# EAGLE design ambika_polivoks (EAGLE 7.7.0)

## Sheet 1 of 4: MCU, DAC
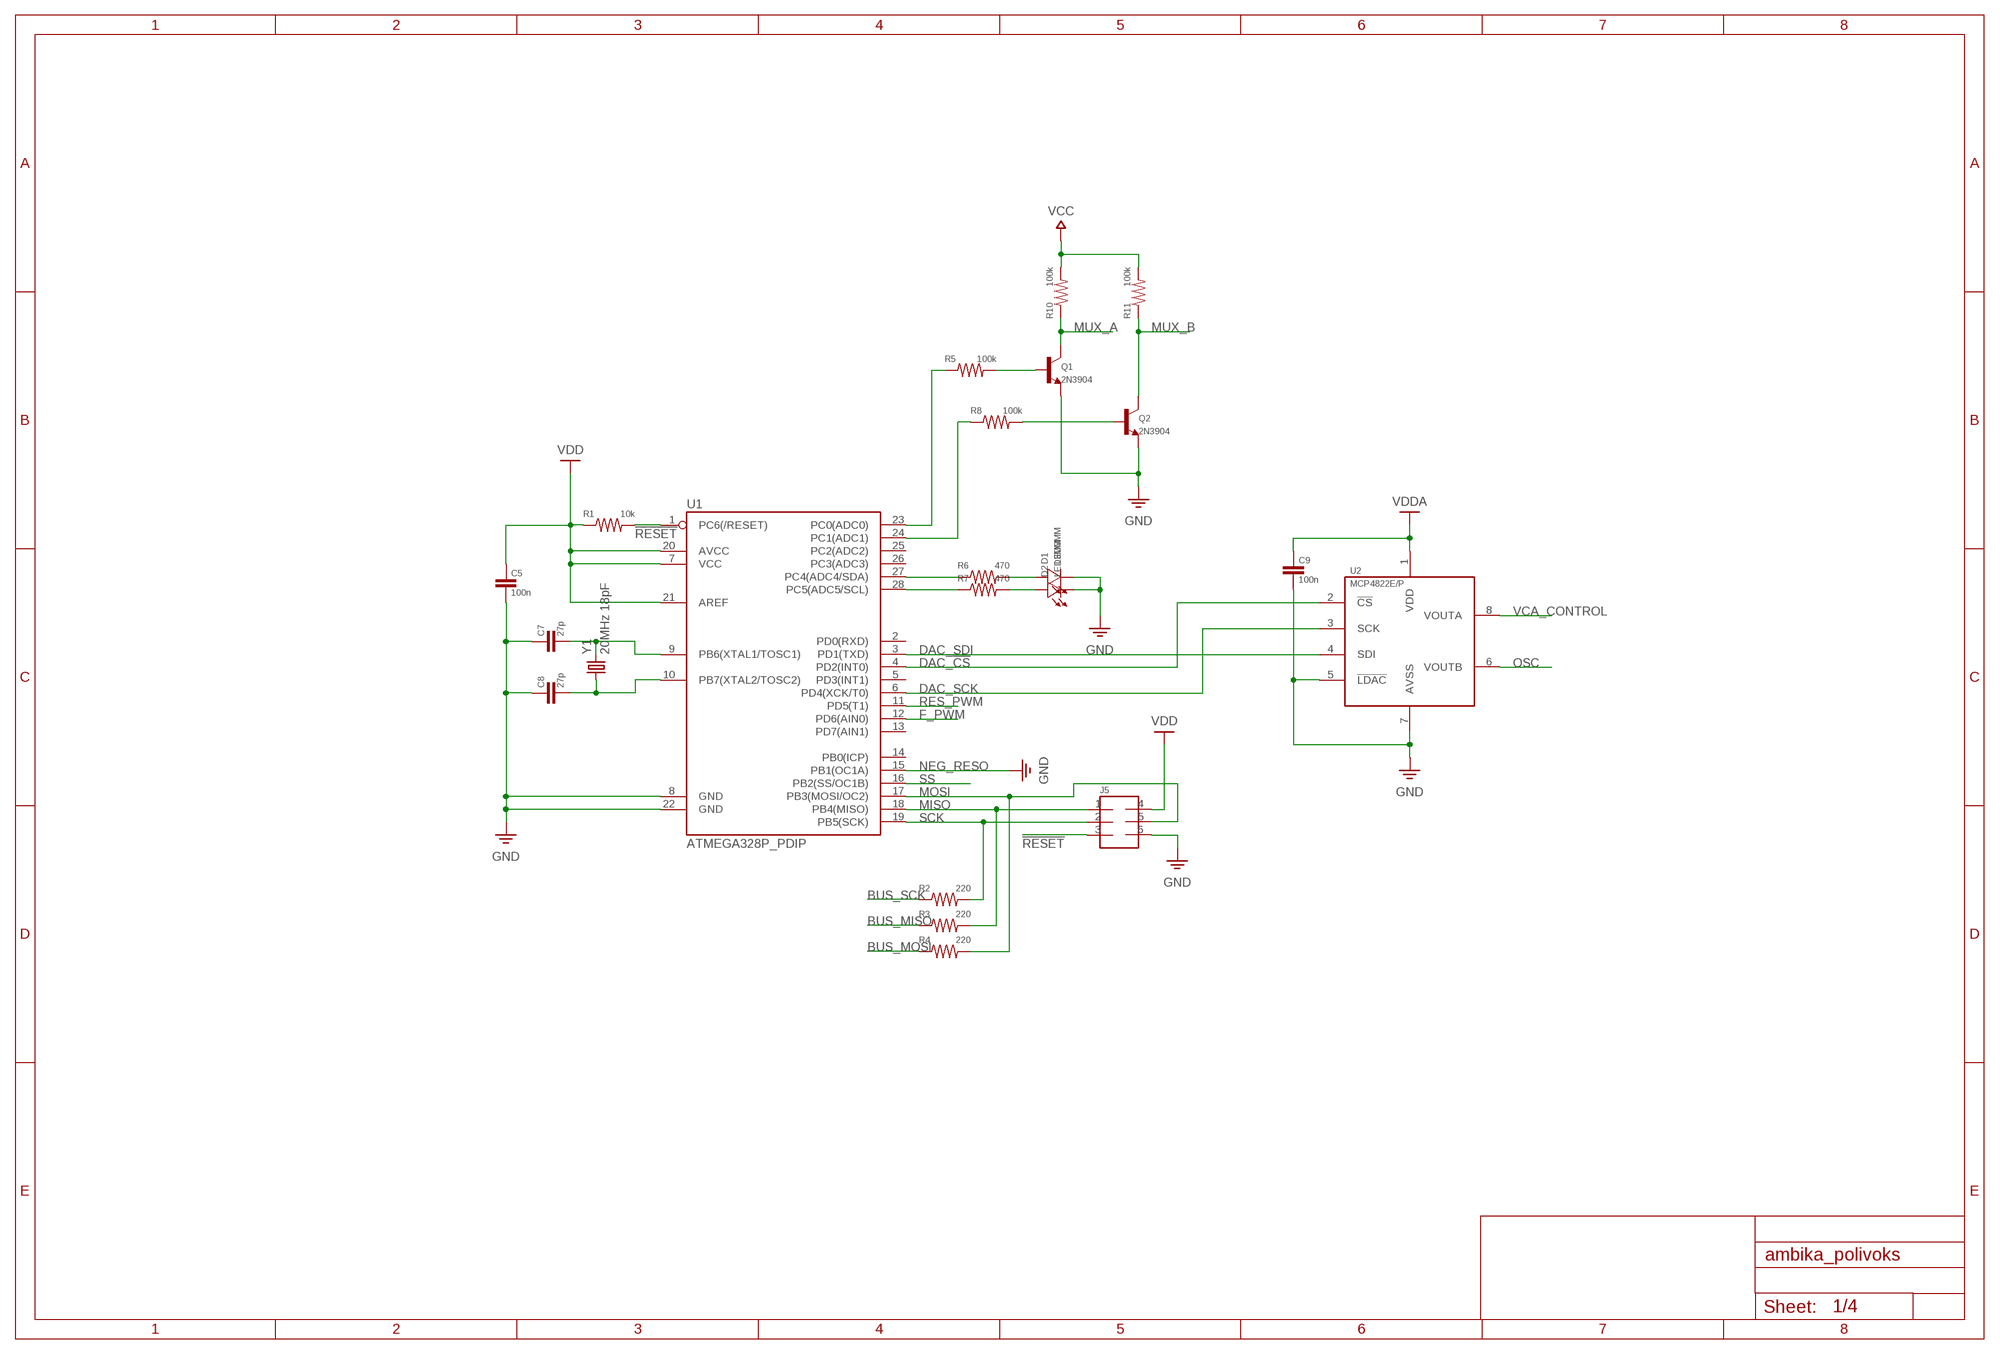
[diagram p0: schematic, sheet 1]

### Parts
C5  100n  CAPACITOR  [CAP_0.1]
C7  27p  CAPACITOR  [CAP_0.1]
C8  27p  CAPACITOR  [CAP_0.1]
C9  100n  CAPACITOR  [CAP_0.1]
D1  LED3MM  [LED3MM]
D2  LED3MM  [LED3MM]
J5  HEADER_2X3  [HEADER_2X3]
Q1  2N3904  [TO-92_TRI]
Q2  2N3904  [TO-92_TRI]
R1  10k  RESISTOR_PTH_1/4W  [RESISTOR_1/4W]
R2  220  RESISTOR_PTH_1/4W  [RESISTOR_1/4W]
R3  220  RESISTOR_PTH_1/4W  [RESISTOR_1/4W]
R4  220  RESISTOR_PTH_1/4W  [RESISTOR_1/4W]
R5  100k  RESISTOR_PTH_1/4W  [RESISTOR_1/4W]
R6  470  RESISTOR_PTH_1/4W  [RESISTOR_1/4W]
R7  470  RESISTOR_PTH_1/4W  [RESISTOR_1/4W]
R8  100k  RESISTOR_PTH_1/4W  [RESISTOR_1/4W]
R10  100k  RESISTOR_PTH_1/4W  [RESISTOR_1/4W]
R11  100k  RESISTOR_PTH_1/4W  [RESISTOR_1/4W]
U1  ATMEGA328P_PDIP  [DIP28]
U2  MCP4822E/P  [DIP8]
Y1  20MHz 18pF  CRYSTALHC49US  [HC49US]

### Nets
!RESET: J5.3 R1.P$2 U1.1(PC6(/RESET))
BUS_MISO: R3.P$1 ; also sheet 3
BUS_MOSI: R4.P$1 ; also sheet 3
BUS_SCK: R2.P$1 ; also sheet 3
DAC_!CS: U1.4(PD2(INT0)) U2.2(!CS)
DAC_SCK: U1.6(PD4(XCK/T0)) U2.3(SCK)
DAC_SDI: U1.3(PD1(TXD)) U2.4(SDI)
F_PWM: U1.12(PD6(AIN0)) ; also sheet 2
GND: C5.2 C7.1 C8.1 C9.2 D1.K D2.K J5.6 Q1.1(E) Q2.1(E) U1.8(GND) U1.15(PB1(OC1A)) U1.22(GND) U2.5(!LDAC) U2.7(AVSS) ; also sheet 2,3
LED1: D2.A R7.P$2
LED2: D1.A R6.P$2
MISO: J5.1 R3.P$2 U1.18(PB4(MISO))
MOSI: J5.5 R4.P$2 U1.17(PB3(MOSI/OC2))
MUX_A: Q1.3(C) R10.P$1 ; also sheet 2
MUX_B: Q2.3(C) R11.P$1 ; also sheet 2
N$1: C7.2 U1.9(PB6(XTAL1/TOSC1)) Y1.2
N$2: C8.2 U1.10(PB7(XTAL2/TOSC2)) Y1.1
N$3: Q1.2(B) R5.P$2
N$5: Q2.2(B) R8.P$2
N$30: R5.P$1 U1.23(PC0(ADC0))
N$31: R8.P$1 U1.24(PC1(ADC1))
OSC: U2.6(VOUTB) ; also sheet 2
PC4: R6.P$1 U1.27(PC4(ADC4/SDA))
PC5: R7.P$1 U1.28(PC5(ADC5/SCL))
RES_PWM: U1.11(PD5(T1)) ; also sheet 2
SCK: J5.2 R2.P$2 U1.19(PB5(SCK))
SS: U1.16(PB2(SS/OC1B)) ; also sheet 3
VCA_CONTROL: U2.8(VOUTA) ; also sheet 2
VCC: R10.P$2 R11.P$2 ; also sheet 2,3
VDD: C5.1 J5.4 R1.P$1 U1.7(VCC) U1.20(AVCC) U1.21(AREF) ; also sheet 3
VDDA: C9.1 U2.1(VDD) ; also sheet 3
Unconnected: U1.2(PD0(RXD)) U1.5(PD3(INT1)) U1.13(PD7(AIN1)) U1.14(PB0(ICP)) U1.25(PC2(ADC2)) U1.26(PC3(ADC3))

### Notes on the sheet
- NEG_RESO

## Sheet 2 of 4: Analog
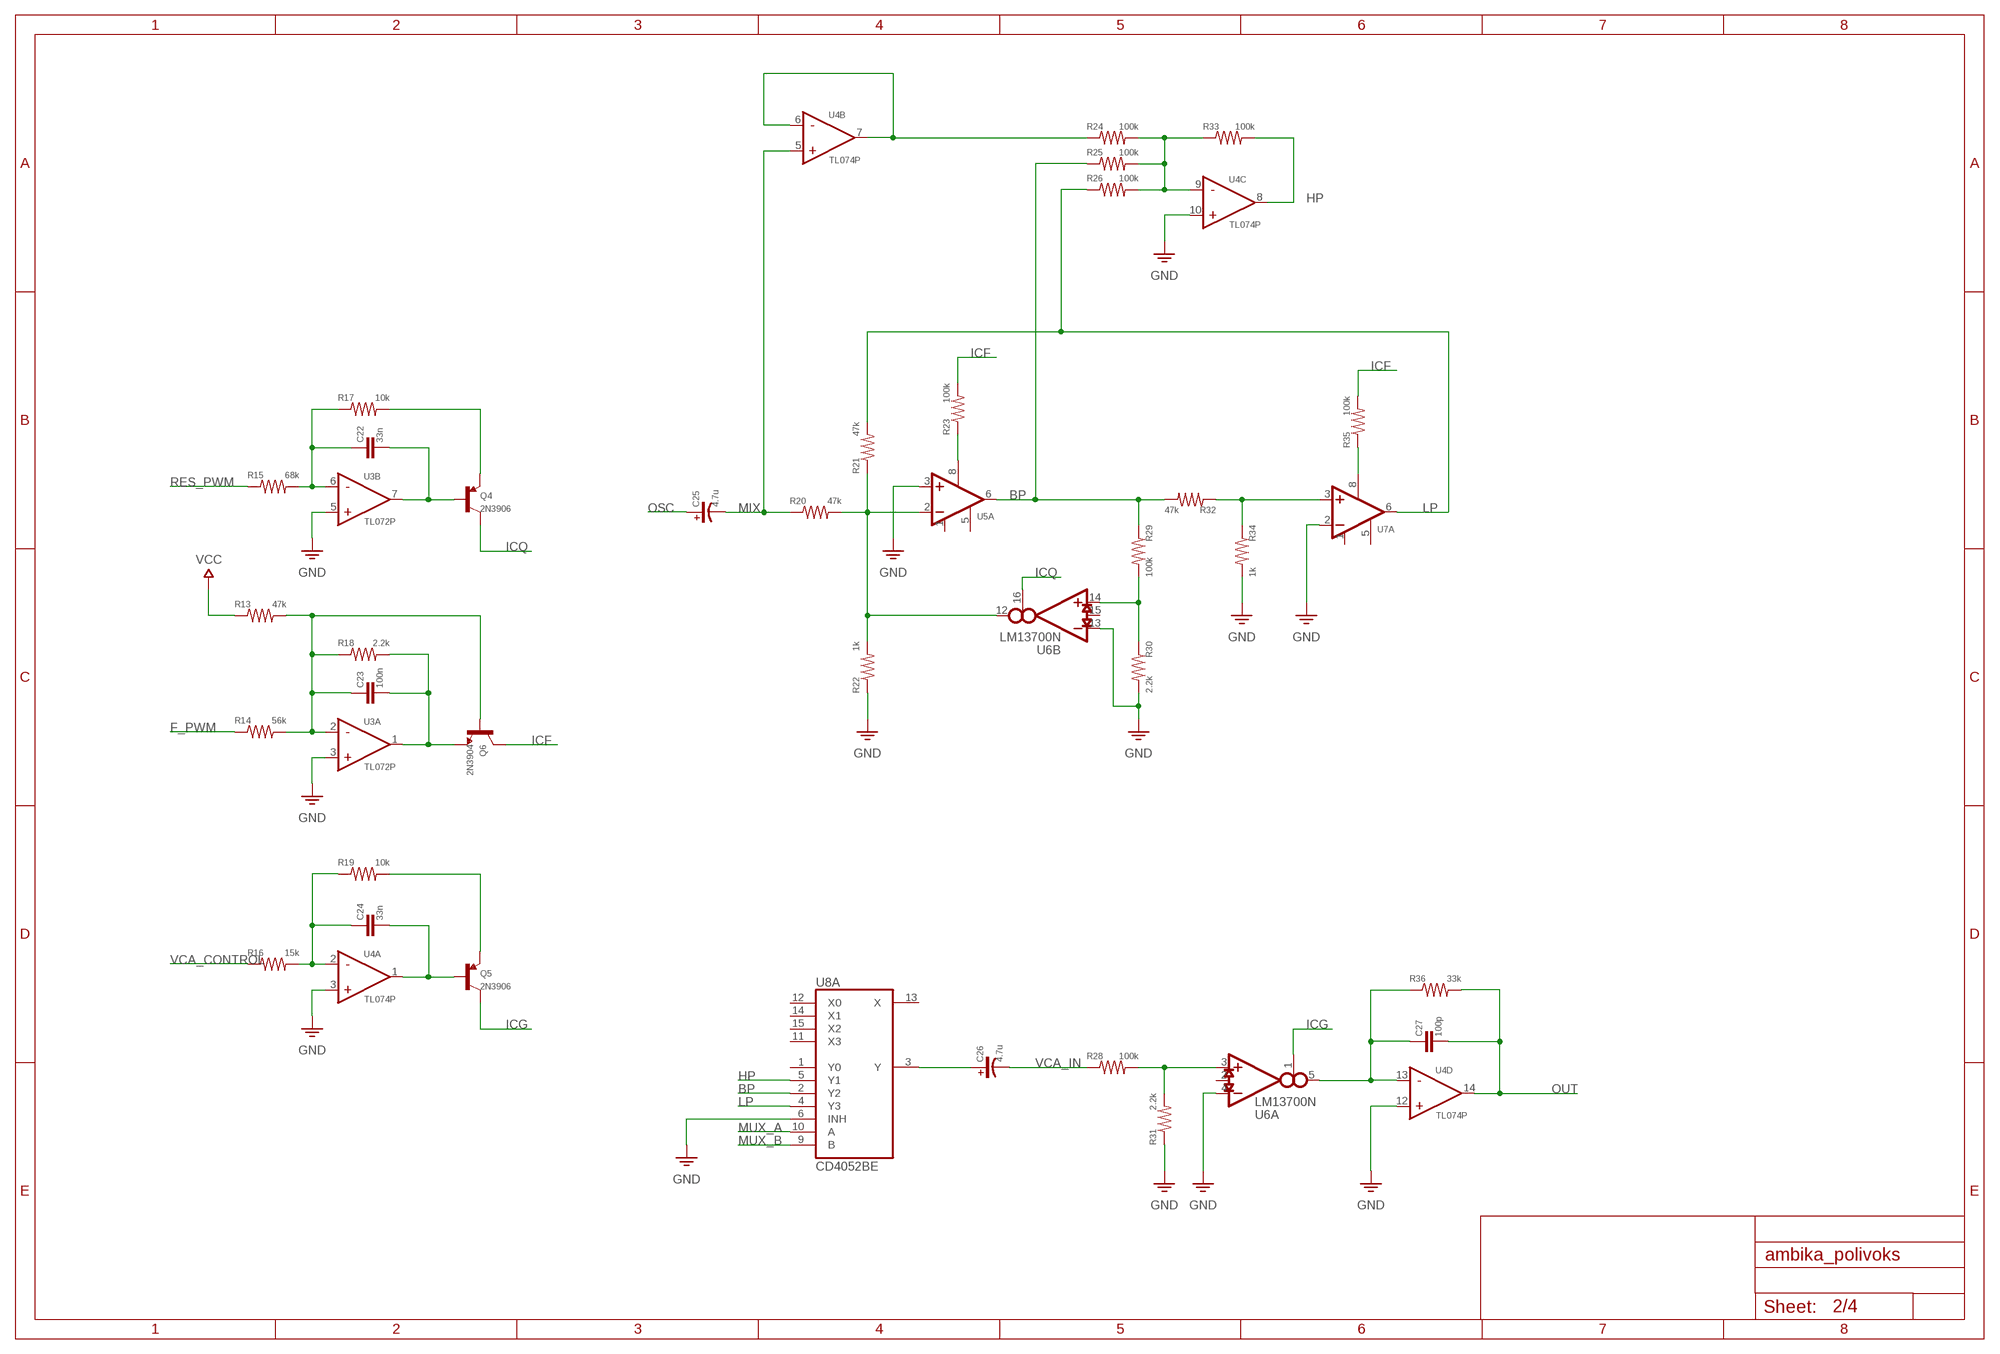
[diagram p1: schematic, sheet 2]

### Parts
C22  33n  CAPACITOR  [CAP_0.1]
C23  100n  CAPACITOR  [CAP_0.1]
C24  33n  CAPACITOR  [CAP_0.1]
C25  4.7u  CAPACITOR_POLARIZED5MM_HORZ1  [CAP_ELEC_5MM_2MM_HORZ1]
C26  4.7u  CAPACITOR_POLARIZED5MM_HORZ2  [CAP_ELEC_5MM_2MM_HORZ2]
C27  100p  CAPACITOR  [CAP_0.1]
Q4  2N3906  [TO-92_TRI]
Q5  2N3906  [TO-92_TRI]
Q6  2N3904  [TO-92_TRI]
R13  47k  RESISTOR_PTH_1/4W  [RESISTOR_1/4W]
R14  56k  RESISTOR_PTH_1/4W  [RESISTOR_1/4W]
R15  68k  RESISTOR_PTH_1/4W  [RESISTOR_1/4W]
R16  15k  RESISTOR_PTH_1/4W  [RESISTOR_1/4W]
R17  10k  RESISTOR_PTH_1/4W  [RESISTOR_1/4W]
R18  2.2k  RESISTOR_PTH_1/4W  [RESISTOR_1/4W]
R19  10k  RESISTOR_PTH_1/4W  [RESISTOR_1/4W]
R20  47k  RESISTOR_PTH_1/4W  [RESISTOR_1/4W]
R21  47k  RESISTOR_PTH_1/4W  [RESISTOR_1/4W]
R22  1k  RESISTOR_PTH_1/4W  [RESISTOR_1/4W]
R23  100k  RESISTOR_PTH_1/4W  [RESISTOR_1/4W]
R24  100k  RESISTOR_PTH_1/4W  [RESISTOR_1/4W]
R25  100k  RESISTOR_PTH_1/4W  [RESISTOR_1/4W]
R26  100k  RESISTOR_PTH_1/4W  [RESISTOR_1/4W]
R28  100k  RESISTOR_PTH_1/4W  [RESISTOR_1/4W]
R29  100k  RESISTOR_PTH_1/4W  [RESISTOR_1/4W]
R30  2.2k  RESISTOR_PTH_1/4W  [RESISTOR_1/4W]
R31  2.2k  RESISTOR_PTH_1/4W  [RESISTOR_1/4W]
R32  47k  RESISTOR_PTH_1/4W  [RESISTOR_1/4W]
R33  100k  RESISTOR_PTH_1/4W  [RESISTOR_1/4W]
R34  1k  RESISTOR_PTH_1/4W  [RESISTOR_1/4W]
R35  100k  RESISTOR_PTH_1/4W  [RESISTOR_1/4W]
R36  33k  RESISTOR_PTH_1/4W  [RESISTOR_1/4W]
U3  TL072P  [DIP8]
U4  TL074P  [DIP14]
U5  LM4250CN  [DIP8]
U6  LM13700N  [DIP16]
U7  LM4250CN  [DIP8]
U8  CD4052BE  [DIP16]

### Nets
BP: R25.P$1 R29.P$1 R32.P$2 U5.6(A:OUTPUT) U8.2(A:Y2)
F_PWM: R14.P$1 ; also sheet 1
GND: R22.P$1 R30.P$2 R31.P$1 R34.P$2 U3.3(A:IN+) U3.5(B:IN+) U4.3(A:IN+) U4.10(C:IN+) U4.12(D:IN+) U5.3(A:V+) U6.4(A:-) U6.13(B:-) U7.2(A:V-) U8.6(A:INH) ; also sheet 1,3
HP: R33.P$2 U4.8(C:OUT) U8.5(A:Y1)
ICF: Q6.3(C) R23.P$2 R35.P$2
ICG: Q5.3(C) U6.1(A:AMP_BIAS)
ICQ: Q4.3(C) U6.16(B:AMP_BIAS)
LP: R21.P$2 R26.P$1 U7.6(A:OUTPUT) U8.4(A:Y3)
MIX: C25.C R20.P$1 U4.5(B:IN+)
MUX_A: U8.10(A:A) ; also sheet 1
MUX_B: U8.9(A:B) ; also sheet 1
N$4: C26.A U8.3(A:Y)
N$8: R24.P$1 U4.6(B:IN-) U4.7(B:OUT)
N$9: R24.P$2 R25.P$2 R26.P$2 R33.P$1 U4.9(C:IN-)
N$13: C23.2 Q6.1(E) R18.P$2 U3.1(A:OUT)
N$14: C22.2 Q4.2(B) U3.7(B:OUT)
N$15: C22.1 R15.P$2 R17.P$1 U3.6(B:IN-)
N$16: Q4.1(E) R17.P$2
N$17: C23.1 Q6.2(B) R13.P$2 R14.P$2 R18.P$1 U3.2(A:IN-)
N$18: R20.P$2 R21.P$1 R22.P$2 U5.2(A:V-) U6.12(B:OUTPUT)
N$19: C24.1 R16.P$2 R19.P$1 U4.2(A:IN-)
N$20: C24.2 Q5.2(B) U4.1(A:OUT)
N$22: Q5.1(E) R19.P$2
N$23: R23.P$1 U5.8(A:SET)
N$25: R32.P$1 R34.P$1 U7.3(A:V+)
N$26: R29.P$2 R30.P$1 U6.14(B:+)
N$27: R28.P$2 R31.P$2 U6.3(A:+)
N$28: C27.1 R36.P$1 U4.13(D:IN-) U6.5(A:OUTPUT)
N$29: R35.P$1 U7.8(A:SET)
OSC: C25.A ; also sheet 1
OUT: C27.2 R36.P$2 U4.14(D:OUT) ; also sheet 3
RES_PWM: R15.P$1 ; also sheet 1
VCA_CONTROL: R16.P$1 ; also sheet 1
VCA_IN: C26.C R28.P$1
VCC: R13.P$1 ; also sheet 1,3
Unconnected: U5.1(A:NULL1) U5.5(A:NULL2) U6.2(A:DIODE_BIAS) U6.7(C:B) U6.8(C:E) U6.9(D:E) U6.10(D:B) U6.15(B:DIODE_BIAS) U7.1(A:NULL1) U7.5(A:NULL2) U8.1(A:Y0) U8.11(A:X3) U8.12(A:X0) U8.13(A:X) U8.14(A:X1) U8.15(A:X2)

## Sheet 3 of 4: Power, connectors
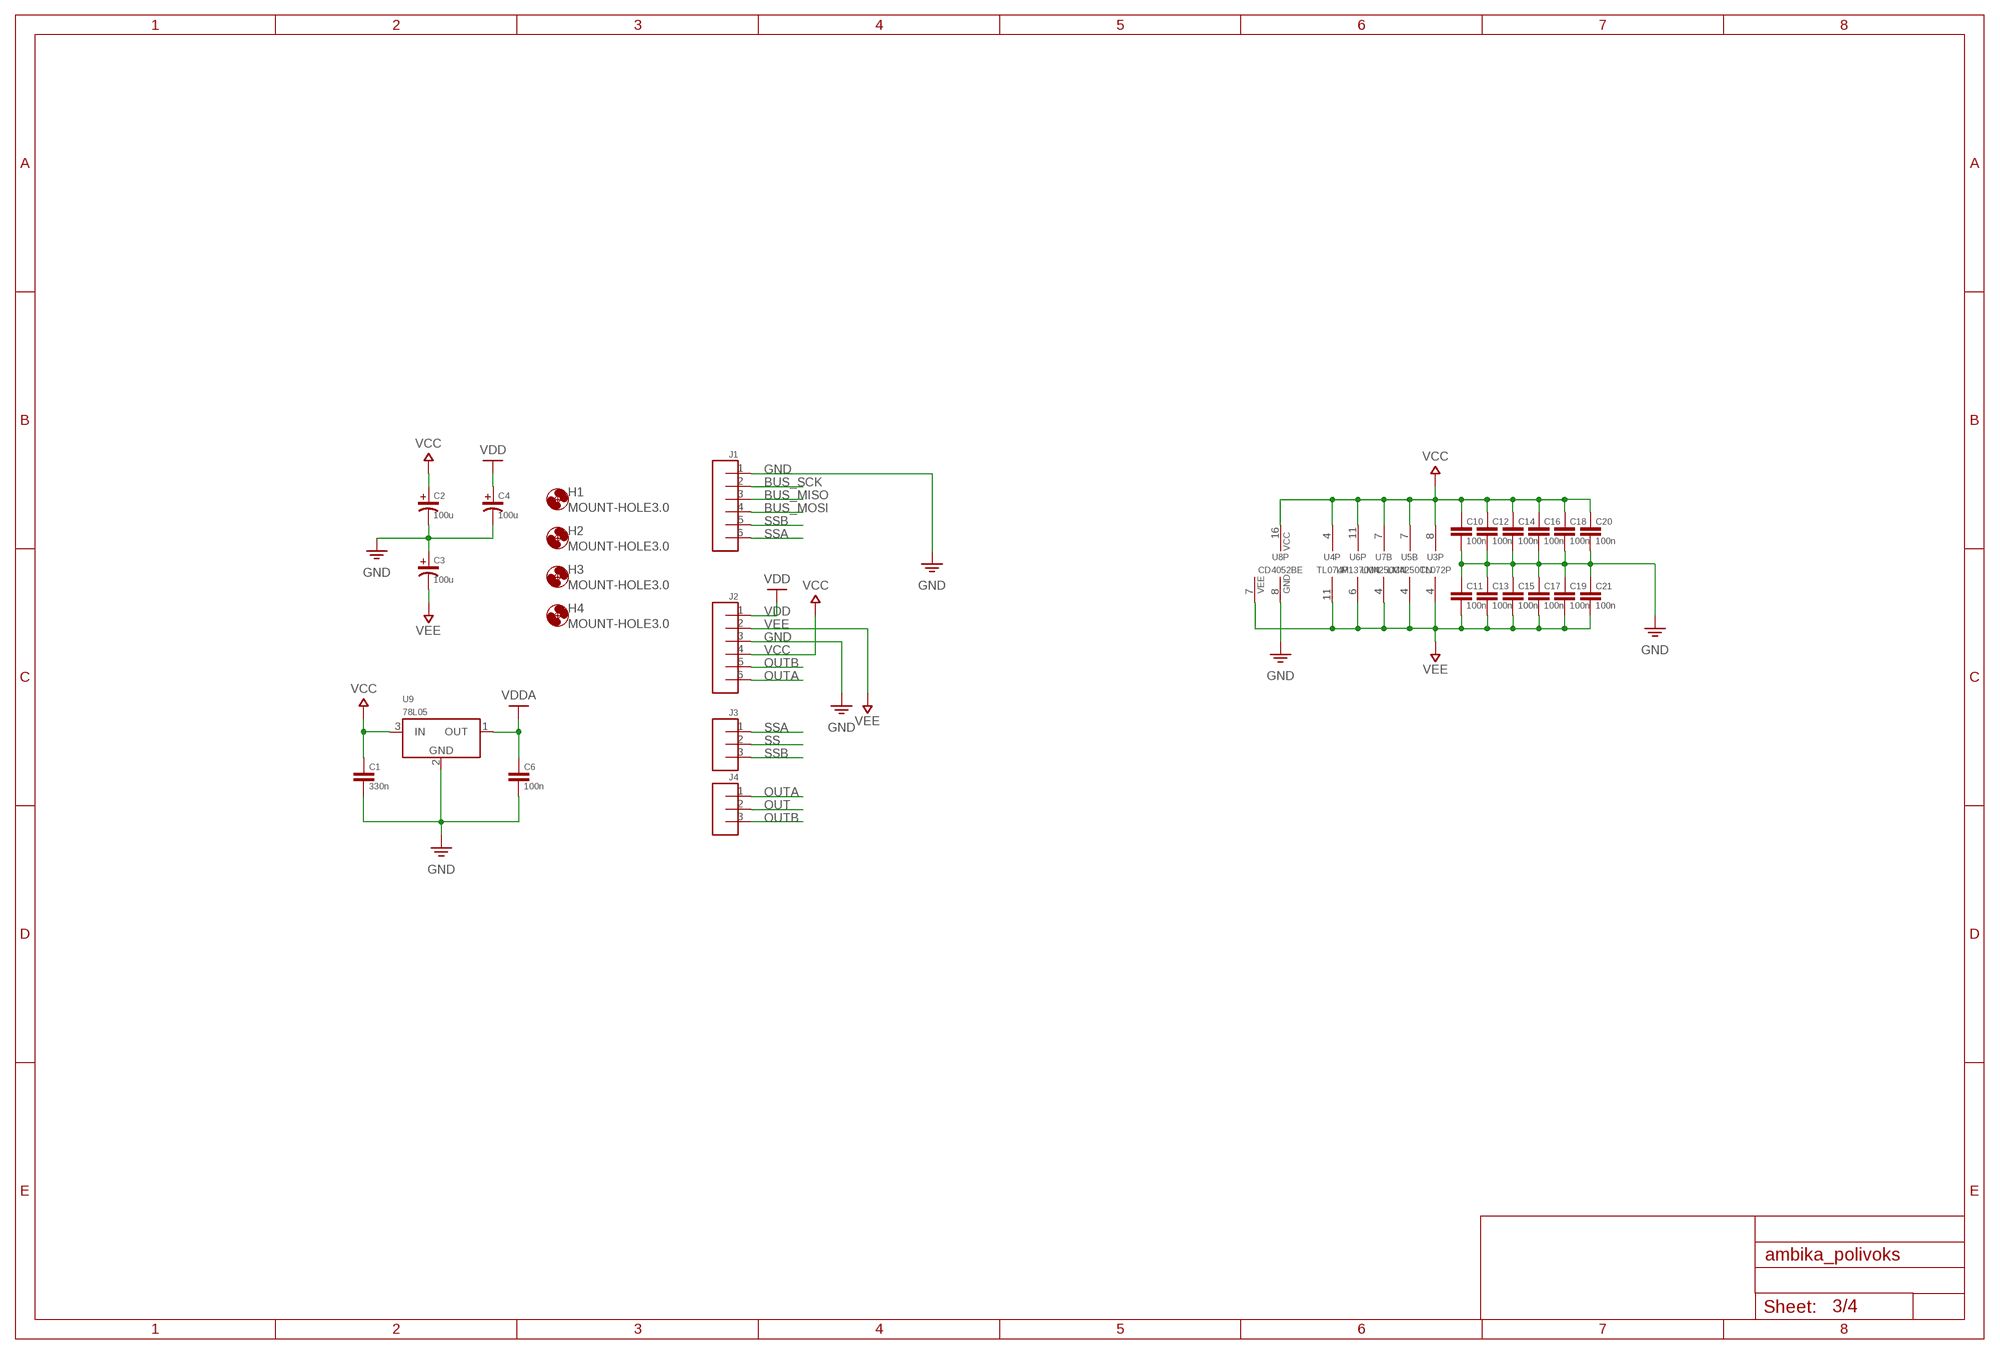
[diagram p2: schematic, sheet 3]

### Parts
C1  330n  CAPACITOR  [CAP_0.1]
C2  100u  CAPACITOR_POLARIZED6.3MM_HORZ2  [CAP_ELEC_6.3MM_2.5MM_HORZ2]
C3  100u  CAPACITOR_POLARIZED6.3MM_HORZ2  [CAP_ELEC_6.3MM_2.5MM_HORZ2]
C4  100u  CAPACITOR_POLARIZED6.3MM_HORZ2  [CAP_ELEC_6.3MM_2.5MM_HORZ2]
C6  100n  CAPACITOR  [CAP_0.1]
C10  100n  CAPACITOR  [CAP_0.1]
C11  100n  CAPACITOR  [CAP_0.1]
C12  100n  CAPACITOR  [CAP_0.1]
C13  100n  CAPACITOR  [CAP_0.1]
C14  100n  CAPACITOR  [CAP_0.1]
C15  100n  CAPACITOR  [CAP_0.1]
C16  100n  CAPACITOR  [CAP_0.1]
C17  100n  CAPACITOR  [CAP_0.1]
C18  100n  CAPACITOR  [CAP_0.1]
C19  100n  CAPACITOR  [CAP_0.1]
C20  100n  CAPACITOR  [CAP_0.1]
C21  100n  CAPACITOR  [CAP_0.1]
H1  MOUNT-HOLE3.0  [3,0]
H2  MOUNT-HOLE3.0  [3,0]
H3  MOUNT-HOLE3.0  [3,0]
H4  MOUNT-HOLE3.0  [3,0]
J1  HEADER_1X6  [HEADER_1X6]
J2  HEADER_1X6  [HEADER_1X6]
J3  HEADER_1X3  [HEADER_1X3]
J4  HEADER_1X3  [HEADER_1X3]
U9  78L05  [TO-92_TRI]

### Nets
BUS_MISO: J1.3 ; also sheet 1
BUS_MOSI: J1.4 ; also sheet 1
BUS_SCK: J1.2 ; also sheet 1
GND: C1.2 C2.C C3.A C4.C C6.2 C10.2 C11.1 C12.2 C13.1 C14.2 C15.1 C16.2 C17.1 C18.2 C19.1 C20.2 C21.1 J1.1 J2.3 U8.8(P:GND) U9.2(GND) ; also sheet 1,2
OUT: J4.2 ; also sheet 2
OUTA: J2.6 J4.1
OUTB: J2.5 J4.3
SS: J3.2 ; also sheet 1
SSA: J1.6 J3.1
SSB: J1.5 J3.3
VCC: C1.1 C2.A C10.1 C12.1 C14.1 C16.1 C18.1 C20.1 J2.4 U3.8(P:VCC) U4.4(P:VCC) U5.7(B:VCC) U6.11(P:VCC) U7.7(B:VCC) U8.16(P:VCC) U9.3(IN) ; also sheet 1,2
VDD: C4.A J2.1 ; also sheet 1
VDDA: C6.1 U9.1(OUT) ; also sheet 1
VEE: C3.C C11.2 C13.2 C15.2 C17.2 C19.2 C21.2 J2.2 U3.4(P:VEE) U4.11(P:VEE) U5.4(B:VEE) U6.6(P:VEE) U7.4(B:VEE) U8.7(P:VEE)

## Sheet 4 of 4: LICENSE
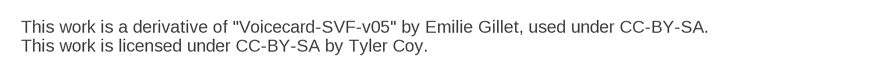
[diagram p3: schematic, sheet 4]

### Notes on the sheet
- This work is a derivative of "Voicecard-SVF-v05" by Emilie Gillet, used under CC-BY-SA.
  This work is licensed under CC-BY-SA by Tyler Coy.

## Library data of the parts
C1 C5-C24 C27 = coy:CAPACITOR
C2-C4 C25 C26 = coy:CAPACITOR_POLARIZED
D1 D2 = coy:LED
H1-H4 = holes:MOUNT-HOLE: MOUNTING HOLE with drill center marker
J1 J2 = coy:HEADER_1X6
J3 J4 = coy:HEADER_1X3
J5 = coy:HEADER_2X3
Q1 Q2 Q6 = coy:2N3904
Q4 Q5 = coy:2N3906
R1-R8 R10 R11 R13-R26 R28-R36 = coy:RESISTOR
U1 = coy:ATMEGA328P_PDIP: uC used in the Arduino 32kb flash, 1k EEPROM, 2k SRAM This is the through-hole version of this chip.
U2 = coy:MCP4822
U3 = coy:TL072
U4 = coy:TL074
U5 U7 = coy:LM4250
U6 = coy:LM13700
U8 = coy:CD4052B
U9 = coy:78*
Y1 = SparkFun-FreqCtrl:CRYSTAL: Various standard crystals. Proven footprints. Spark Fun Electronics SKU : COM-00534

## Board
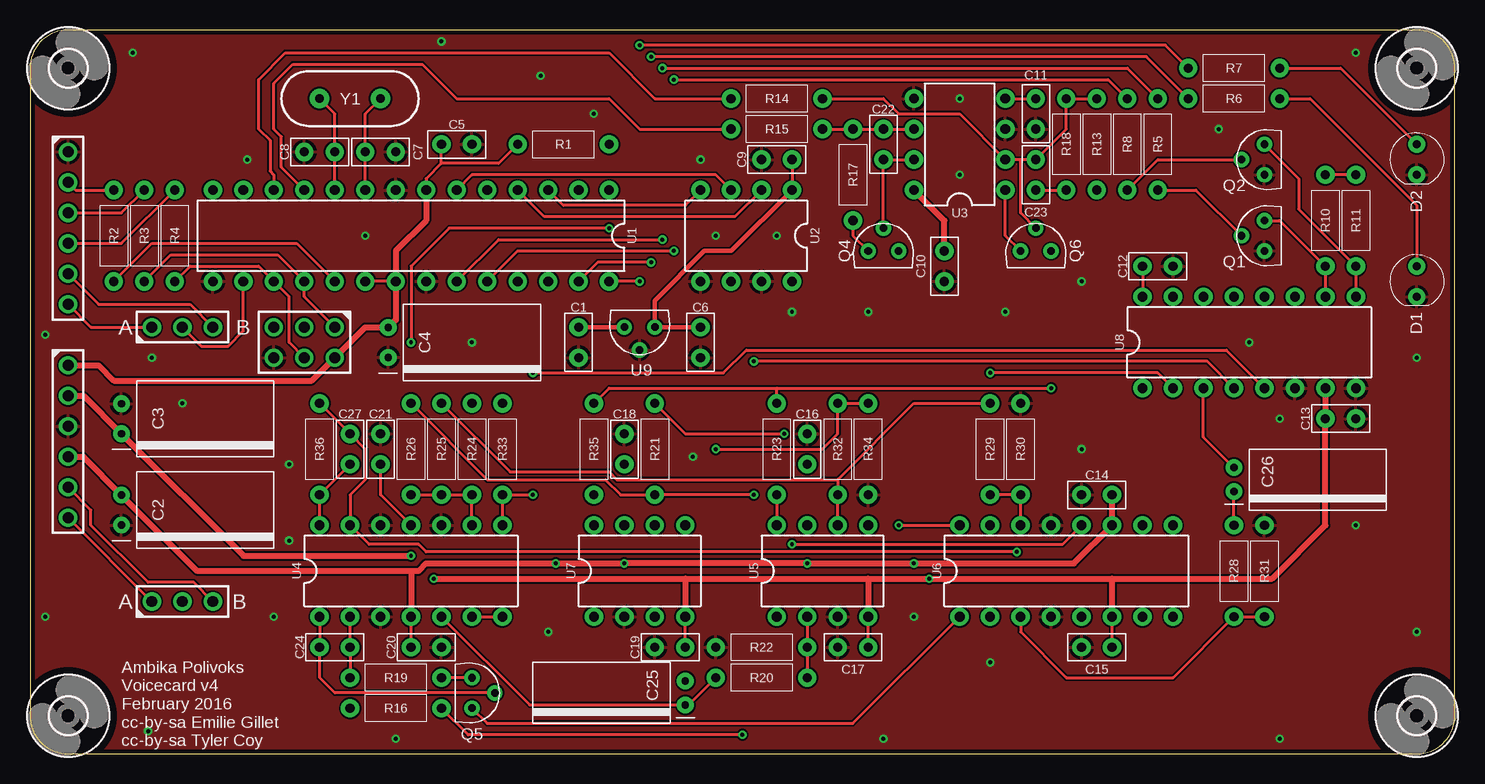
[diagram p4: board, top side]
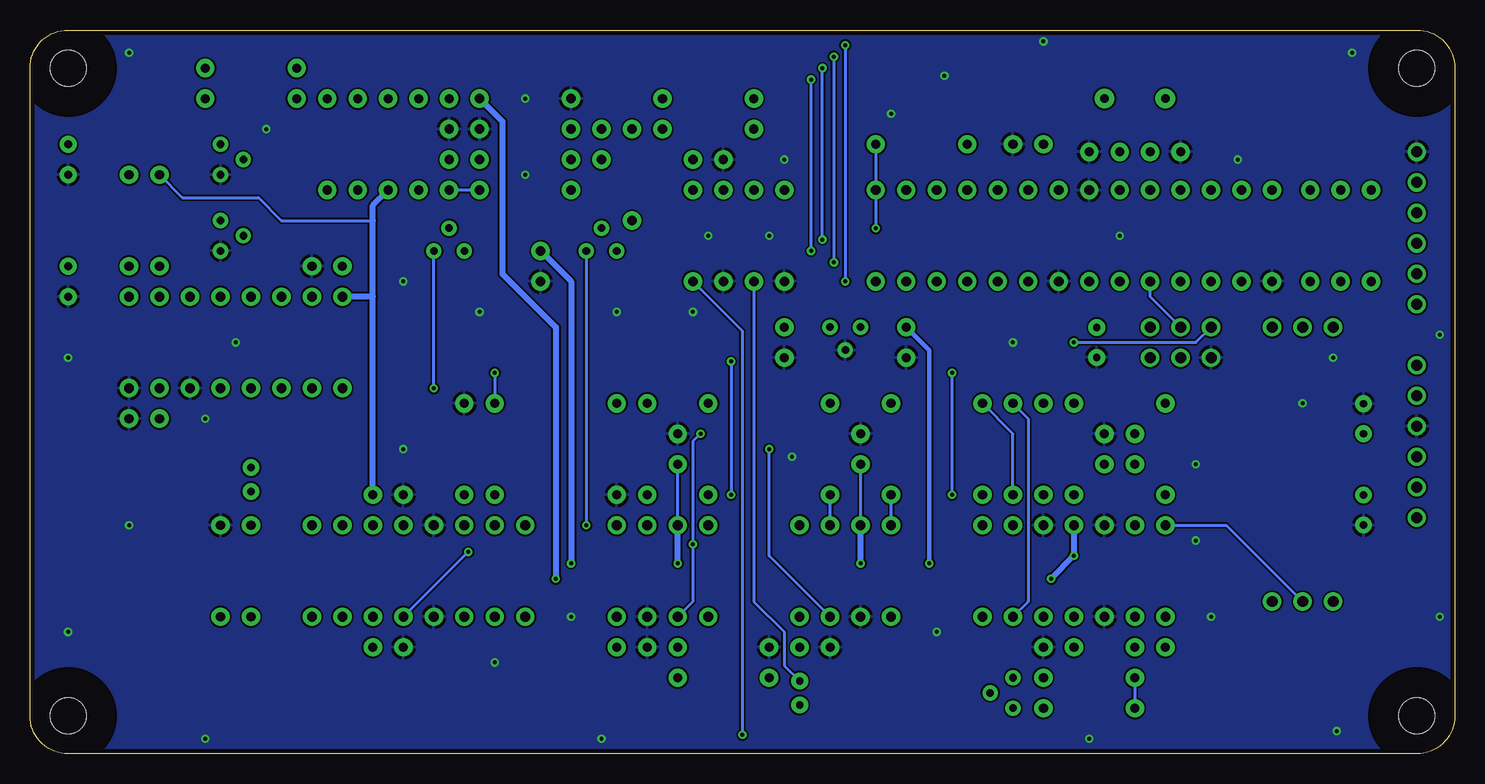
[diagram p5: board, bottom side, seen from below]

Size 118.75 x 60.33 mm. Coordinates in mm from the lower left corner, seen from the top.
Outline: 3.17,0 115.57,0 arc90 118.75,3.17 118.75,57.15 arc90 115.57,60.33 3.17,60.33 arc90 0,57.15 0,3.17 arc90 3.17,0
Copper layers (1*16): Top 0.0356mm / dielectric 1.5011mm / Bottom 0.0356mm
Design rules "LaenPCBOrder": minimum track width 6mil, minimum drill 13mil, track to track 6mil, track to pad 6mil, pad to pad 6mil, via to via 6mil, smd to smd 6mil, copper to edge 15mil, drill to drill 6mil, minimum pad ring 7mil, minimum via ring 7mil, stop-mask expansion 3mil, vias tented up to drill 14mil, thermal gap 10mil

### Footprints (pad centres in the part's own frame; a part is rotated, then mirrored left to right if it is on the bottom)
CAP_0.1 = drill 0.762 pad 1.524: 1 -1.27,0; 2 1.27,0
CAP_ELEC_6.3MM_2.5MM_HORZ2 = drill 0.6 pad 1.4: A 1.25,0; C -1.25,0
CAP_ELEC_5MM_2MM_HORZ1 = drill 0.6 pad 1.4: A 1,0; C -1,0
CAP_ELEC_5MM_2MM_HORZ2 = drill 0.6 pad 1.4: A 1,0; C -1,0
LED3MM = drill 0.65 pad 1.4: A -1.27,0; K 1.27,0
3,0 = hole 3: 0,0
HEADER_1X6 = drill 0.914 pad 1.524: 1 0,0; 2 0,-2.54; 3 0,-5.08; 4 0,-7.62; 5 0,-10.16; 6 0,-12.7
HEADER_1X3 = drill 0.914 pad 1.524: 1 0,0; 2 0,-2.54; 3 0,-5.08
HEADER_2X3 = drill 0.914 pad 1.524: 1 0,0; 2 0,-2.54; 3 0,-5.08; 4 2.54,0; 5 2.54,-2.54; 6 2.54,-5.08
TO-92_TRI = drill 0.635 pad 1.27: 1 -1.27,0; 2 0,1.905; 3 1.27,0
RESISTOR_1/4W = drill 0.762 pad 1.524: P$1 -3.81,0; P$2 3.81,0
DIP28 = drill 0.813 pad 1.524: 1 -16.51,-3.81; 2 -13.97,-3.81; 3 -11.43,-3.81; 4 -8.89,-3.81; 5 -6.35,-3.81; 6 -3.81,-3.81; 7 -1.27,-3.81; 8 1.27,-3.81; 9 3.81,-3.81; 10 6.35,-3.81; 11 8.89,-3.81; 12 11.43,-3.81; 13 13.97,-3.81; 14 16.51,-3.81; 15 16.51,3.81; 16 13.97,3.81; 17 11.43,3.81; 18 8.89,3.81; 19 6.35,3.81; 20 3.81,3.81; 21 1.27,3.81; 22 -1.27,3.81; 23 -3.81,3.81; 24 -6.35,3.81; 25 -8.89,3.81; 26 -11.43,3.81; 27 -13.97,3.81; 28 -16.51,3.81
DIP8 = drill 0.813 pad 1.524: 1 -3.81,-3.81; 2 -1.27,-3.81; 3 1.27,-3.81; 4 3.81,-3.81; 5 3.81,3.81; 6 1.27,3.81; 7 -1.27,3.81; 8 -3.81,3.81
DIP14 = drill 0.813 pad 1.524: 1 -7.62,-3.81; 2 -5.08,-3.81; 3 -2.54,-3.81; 4 0,-3.81; 5 2.54,-3.81; 6 5.08,-3.81; 7 7.62,-3.81; 8 7.62,3.81; 9 5.08,3.81; 10 2.54,3.81; 11 0,3.81; 12 -2.54,3.81; 13 -5.08,3.81; 14 -7.62,3.81
DIP16 = drill 0.813 pad 1.524: 1 -8.89,-3.81; 2 -6.35,-3.81; 3 -3.81,-3.81; 4 -1.27,-3.81; 5 1.27,-3.81; 6 3.81,-3.81; 7 6.35,-3.81; 8 8.89,-3.81; 9 8.89,3.81; 10 6.35,3.81; 11 3.81,3.81; 12 1.27,3.81; 13 -1.27,3.81; 14 -3.81,3.81; 15 -6.35,3.81; 16 -8.89,3.81
HC49US = drill 0.7 pad 1.651: 1 -2.54,0; 2 2.54,0

### Placement (x,y rotation side)
C1  45.72,34.29 270 top
C2  7.62,20.32 90 top
C3  7.62,27.94 90 top
C4  29.84,34.29 90 top
C5  35.56,50.8 0 top
C6  55.88,34.29 270 top
C7  29.21,50.16 180 top
C8  24.13,50.16 0 top
C9  62.23,49.53 180 top
C10  76.2,40.64 270 top
C11  83.82,53.34 90 top
C12  93.98,40.64 0 top
C13  109.22,27.94 180 top
C14  88.9,21.59 180 top
C15  88.9,8.89 0 top
C16  64.77,25.4 90 top
C17  68.58,8.89 0 top
C18  49.53,25.4 90 top
C19  53.34,8.89 0 top
C20  33.02,8.89 0 top
C21  29.21,25.4 270 top
C22  71.12,50.8 270 top
C23  83.82,48.26 270 top
C24  25.4,8.89 180 top
C25  54.61,5.08 90 top
C26  100.33,22.86 90 top
C27  26.67,25.4 270 top
D1  115.57,39.37 270 top
D2  115.57,49.53 270 top
H1  3.17,57.15 0 top
H2  3.17,3.17 0 top
H3  115.57,3.17 0 top
H4  115.57,57.15 0 top
J1  3.17,50.16 0 top
J2  3.17,32.38 0 top
J3  10.16,35.56 90 top
J4  10.16,12.7 90 top
J5  25.4,35.56 270 top
Q1  102.87,43.18 90 top
Q2  102.87,49.53 90 top
Q4  71.12,41.91 0 top
Q5  36.83,5.08 270 top
Q6  83.82,41.91 0 top
R1  44.45,50.8 0 top
R2  6.99,43.18 270 top
R3  9.53,43.18 270 top
R4  12.06,43.18 270 top
R5  93.98,50.8 270 top
R6  100.33,54.61 0 top
R7  100.33,57.15 0 top
R8  91.44,50.8 270 top
R10  107.95,44.45 90 top
R11  110.49,44.45 90 top
R13  88.9,50.8 90 top
R14  62.23,54.61 0 top
R15  62.23,52.07 0 top
R16  30.48,3.81 180 top
R17  68.58,48.26 270 top
R18  86.36,50.8 270 top
R19  30.48,6.35 0 top
R20  60.96,6.35 0 top
R21  52.07,25.4 270 top
R22  60.96,8.89 0 top
R23  62.23,25.4 90 top
R24  36.83,25.4 270 top
R25  34.29,25.4 270 top
R26  31.75,25.4 270 top
R28  100.33,15.24 270 top
R29  80.01,25.4 270 top
R30  82.55,25.4 90 top
R31  102.87,15.24 270 top
R32  67.31,25.4 270 top
R33  39.37,25.4 270 top
R34  69.85,25.4 270 top
R35  46.99,25.4 90 top
R36  24.13,25.4 270 top
U1  31.75,43.18 180 top
U2  59.69,43.18 180 top
U3  77.47,50.8 90 top
U4  31.75,15.24 0 top
U5  66.04,15.24 0 top
U6  86.36,15.24 0 top
U7  50.8,15.24 0 top
U8  101.6,34.29 0 top
U9  50.8,35.56 180 top
Y1  26.67,54.61 0 top

### Tracks (layer width: path | path; a pad name or v marks a point on that pad's centre or on a via)
!RESET  (via drill 0.33 pad 0.51)
  Top 0.254: v48.26,43.81 34.92,43.81 31.75,40.64 v31.75,34.29
  Bottom 0.254: R1.P$2 U1.1 v48.26,43.81 | v31.75,34.29 21.59,34.29 J5.3
BP  (via drill 0.33 pad 0.51)
  Top 0.254: U5.6 R32.P$2 67.31,22.86 | R29.P$1 73.66,29.21 67.31,22.86 | R25.P$1 40.01,23.5 48.26,23.5 48.9,22.86 67.31,22.86 | v80.01,31.75 93.98,31.75 U8.2
  Bottom 0.254: v80.01,31.75 R29.P$1
BUS_MISO
  Top 0.254: J1.3 7.62,45.09 R3.P$1
BUS_MOSI
  Top 0.254: J1.4 7.62,42.55 R4.P$1
BUS_SCK
  Top 0.254: J1.2 3.81,46.99 R2.P$1
DAC_!CS
  Top 0.254: U2.2 58.74,44.77 42.86,44.77 U1.4
DAC_SCK
  Top 0.254: U2.3 57.15,48.26 36.83,48.26 U1.6
DAC_SDI
  Top 0.254: U2.4 54.61,45.72 44.45,45.72 U1.3
F_PWM
  Top 0.254: R14.P$1 52.07,54.61 48.26,58.42 21.27,58.42 19.05,56.2 19.05,52.07 20,51.12 20,48.58 20.32,48.26 U1.12
GND  (via drill 0.33 pad 0.51)
  other vias: 8.57,58.42 42.55,56.52 34.29,59.37 110.49,58.42 115.57,33.02 115.57,10.16 104.14,1.27 71.12,1.27 30.48,1.27 9.84,1.91 1.27,11.43 1.27,34.92 21.59,17.78 21.59,24.13 36.83,34.29 27.94,43.18 55.88,49.53 46.99,53.34 57.15,43.18 62.23,43.18 63.5,36.83 69.85,36.83 81.28,36.83 87.63,39.37 87.63,25.4 104.14,27.94 101.6,34.29 99.06,52.07 77.47,54.61 77.47,48.26 43.18,10.16 73.66,11.43 20.32,11.43 12.7,29.21 10.16,33.02 80.01,7.62 55.24,24.77 18.1,49.53 110.49,19.05
  pour Bottom: 0,0 0,60.33 118.75,60.33 118.75,0
  pour Top: 0,0 0,60.33 118.75,60.33 118.75,0
HP  (via drill 0.33 pad 0.51)
  Top 0.254: U4.8 R33.P$2 v41.91,21.59 | v41.91,31.75 57.78,31.75 59.69,33.66 99.69,33.66 U8.5
  Bottom 0.254: v41.91,21.59 v41.91,31.75
ICF  (via drill 0.33 pad 0.51)
  Top 0.254: R35.P$2 48.26,30.48 62.23,30.48 | R23.P$2 62.23,30.48 | 62.23,30.48 v85.09,30.48
  Bottom 0.254: v85.09,30.48 Q6.3
ICG
  Top 0.254: Q5.3 38.1,2.54 68.58,2.54 U6.1
ICQ  (via drill 0.33 pad 0.51)
  Top 0.254: v72.39,19.05 U6.16
  Bottom 0.254: Q4.3 v72.39,19.05
LED1
  Top 0.254: R7.P$2 109.22,57.15 D2.A
LED2
  Top 0.254: D1.A 115.57,45.72 106.68,54.61 R6.P$2
LP  (via drill 0.33 pad 0.51)
  Top 0.254: R26.P$1 38.1,22.86 47.94,22.86 49.21,21.59 R21.P$2 v60.33,21.59 | v60.33,32.7 98.11,32.7 U8.4
  Bottom 0.254: U7.6 R21.P$2 | v60.33,32.7 v60.33,21.59
MISO
  Top 0.254: J5.1 22.86,38.1 U1.18 20.64,41.59 11.75,41.59 R3.P$2
MIX
  Top 0.254: U4.5 41.64,4.08 C25.C 54.88,4.08 R20.P$1
MOSI
  Top 0.254: J5.5 21.59,34.29 21.59,38.1 U1.17 19.05,40.64 13.34,40.64 R4.P$2
MUX_A
  Top 0.254: U8.10 R10.P$1 104.14,44.45 Q1.3
MUX_B
  Top 0.254: U8.9 R11.P$1 105.73,45.4 105.73,47.94 Q2.3
N$1
  Top 0.254: U1.9 C7.2 27.94,53.34 Y1.2
N$2
  Top 0.254: U1.10 C8.2 25.4,53.34 Y1.1
N$3
  Top 0.254: R5.P$2 97.16,46.99 Q1.2
N$4
  Top 0.254: C26.A 97.79,26.4 U8.3
N$5
  Top 0.254: R8.P$2 93.98,49.53 Q2.2
N$8
  Top 0.254: U4.6 U4.7
  Bottom 0.254: R24.P$1 35.56,27.94 35.56,12.7 U4.6
N$9
  Top 0.254: R26.P$2 R25.P$2 R24.P$2 U4.9
  Bottom 0.254: R24.P$2 36.83,26.67 R33.P$1
N$13
  Top 0.254: C23.2 R18.P$2 | Q6.1 81.28,43.18 U3.1
  Bottom 0.254: U3.1 C23.2
N$14
  Top 0.254: U3.7 C22.2 Q4.2
N$15
  Top 0.254: U3.6 C22.1 R17.P$1 R15.P$2
N$16
  Top 0.254: R17.P$2 68.58,43.18 Q4.1
N$17
  Top 0.254: R13.P$2 R18.P$1 86.36,52.07 C23.1 82.55,49.53 | 82.55,49.53 U3.2 77.47,53.34 72.39,53.34 71.12,54.61 R14.P$2 | Q6.2 82.55,45.09 82.55,49.53
N$18  (via drill 0.33 pad 0.51)
  Top 0.254: U5.2 R22.P$2 R20.P$2 | R21.P$1 54.61,26.67 v62.87,26.67 | v63.5,17.46 86.04,17.46 U6.12
  Bottom 0.254: v62.87,26.67 63.5,26.04 v63.5,17.46 63.5,12.7 U5.2
N$19
  Top 0.254: U4.2 C24.1 R19.P$1
  Bottom 0.254: R19.P$1 R16.P$2
N$20
  Top 0.254: U4.1 C24.2 24.13,6.35 25.4,5.08 Q5.2
N$22
  Top 0.254: Q5.1 R19.P$2
N$23
  Top 0.254: R23.P$1 U5.8
N$25  (via drill 0.33 pad 0.51)
  Top 0.254: R34.P$1 R32.P$1 67.31,26.67 66.04,25.4 v57.15,25.4
  Bottom 0.254: U7.3 57.15,16.51 v57.15,25.4
N$26
  Top 0.254: U6.14 R30.P$1 R29.P$2
N$27
  Top 0.254: U6.3 82.55,10.16 86.36,6.35 95.25,6.35 R28.P$2 R31.P$2
N$28  (via drill 0.33 pad 0.51)
  Top 0.254: R36.P$1 C27.1 27.94,25.4 27.94,22.86 26.67,21.59 U4.13 28.26,17.46 32.38,17.46 33.02,16.83 v82.23,16.83
  Bottom 0.254: U6.5 v82.23,16.83
N$29
  Bottom 0.254: U7.8 R35.P$1
N$30  (via drill 0.33 pad 0.51)
  Top 0.254: v52.7,42.86 39.05,42.86 U1.23 | v52.7,57.15 91.44,57.15 R5.P$1
  Bottom 0.254: v52.7,42.86 v52.7,57.15
N$31  (via drill 0.33 pad 0.51)
  Top 0.254: v53.66,41.91 40.64,41.91 U1.24 | v53.66,56.2 89.85,56.2 R8.P$1
  Bottom 0.254: v53.66,41.91 v53.66,56.2
OSC
  Bottom 0.254: U2.6 58.42,12.7 55.88,10.16 55.88,7.35 C25.A
OUT
  Top 0.254: U4.14 R36.P$2 C27.2
  Bottom 0.254: U4.14 19.05,19.05 J4.2
OUTA
  Top 0.254: J4.1 J2.6
OUTB
  Top 0.254: J4.3 13.65,14.29 9.84,14.29 5.08,19.05 5.08,20.32 J2.5
PC4  (via drill 0.33 pad 0.51)
  Top 0.254: v51.75,58.1 93.03,58.1 R6.P$1 | v51.75,40.96 47.31,40.96 U1.27
  Bottom 0.254: v51.75,58.1 v51.75,40.96
PC5  (via drill 0.33 pad 0.51)
  Top 0.254: v50.8,59.05 94.61,59.05 R7.P$1 | v50.8,39.37 U1.28
  Bottom 0.254: v50.8,59.05 v50.8,39.37
RES_PWM
  Top 0.254: R15.P$1 50.8,52.07 48.26,54.61 35.56,54.61 32.7,57.47 21.91,57.47 20.32,55.88 20.32,52.07 20.95,51.44 20.95,48.9 U1.11
SCK
  Top 0.254: R2.P$2 10.16,42.55 22.23,42.55 U1.19
  Bottom 0.254: J5.2 25.4,38.1 U1.19
SS
  Top 0.254: J3.2 14.29,33.97 16.51,33.97 17.78,35.24 U1.16
SSA
  Top 0.254: J1.6 5.08,35.56 J3.1
SSB
  Top 0.254: J1.5 5.71,37.47 13.34,37.47 J3.3
VCA_CONTROL  (via drill 0.33 pad 0.51)
  Top 0.254: v59.37,1.59 36.51,1.59 R16.P$1
  Bottom 0.254: U2.8 59.37,35.24 v59.37,1.59
VCA_IN
  Top 0.254: R28.P$1 C26.C
VCC  (via drill 0.33 pad 0.51)
  Top 0.254: C20.1 U4.4 | R11.P$2 R10.P$2 | C12.1 U8.16
  Top 0.381: C1.1 U9.3
  Top 0.508: C14.1 U6.11 87,15.88 v73.66,15.88 v64.77,15.88 v49.53,15.88 v43.81,15.88 33.02,15.88 32.38,15.24 31.75,15.24 | C10.1 76.2,44.45 U3.8 | J2.4 4.42,24.77 C2.A 13.95,15.24 31.75,15.24 | 31.75,15.24 U4.4
  Bottom 0.254: U7.7 C18.1 | U5.7 C16.1 | R10.P$2 106.05,46.35 99.69,46.35 97.79,44.45 90.17,44.45
  Bottom 0.381: C1.1 43.81,33.66 v43.81,15.88
  Bottom 0.508: v64.77,15.88 U5.7 | v49.53,15.88 U7.7 | C14.1 90.17,38.1 | 90.17,38.1 90.17,44.45 90.17,45.72 R13.P$1 | C10.1 73.66,39.37 v73.66,15.88 | 90.17,38.1 U8.16
VDD
  Top 0.254: U1.21 U1.20 | R1.P$1 39.05,49.21 34.29,49.21 | 34.29,49.21 C5.1 | 34.29,49.21 33.02,47.94 U1.7
  Top 0.508: U1.7 33.02,44.45 30.48,41.91 U1.21 30.48,36.17 C4.A 27.92,35.54 J5.4 23.5,31.11 6.99,31.11 5.71,32.38 J2.1
VDDA
  Top 0.254: C9.1 U2.1
  Top 0.381: C6.1 U9.1 52.07,37.78 56.2,41.91 58.42,41.91 U2.1
VEE  (via drill 0.33 pad 0.51)
  Top 0.254: U4.11 29.21,21.59 C21.2 | C19.2 U7.4 | C15.2 U6.6 | C17.2 U5.4 | U3.4 C11.2
  Top 0.508: v33.66,14.61 54.61,14.61 | 54.61,14.61 U7.4 | 54.61,14.61 69.85,14.61 | 69.85,14.61 U5.4 | 69.85,14.61 v74.93,14.61 90.17,14.61 | 90.17,14.61 103.5,14.61 107.95,19.05 C13.2 U8.7 | U6.6 90.17,14.61 | J2.2 4.46,29.84 C3.C 17.8,16.51 v31.75,16.51
  Bottom 0.508: U4.11 v31.75,16.51 v33.66,14.61 | U3.4 79.38,52.7 79.38,40.01 74.93,35.56 v74.93,14.61

### Text on the board
tPlace: A | B | A | B | Ambika Polivoks / Voicecard v4 / February 2016 / cc-by-sa Emilie Gillet / cc-by-sa Tyler Coy
tStop: <3 u bb!
Document: This work is a derivative of "Voicecard-SVF-v05" by Emilie Gillet, used under CC-BY-SA. / This work is licensed under CC-BY-SA by Tyler Coy.